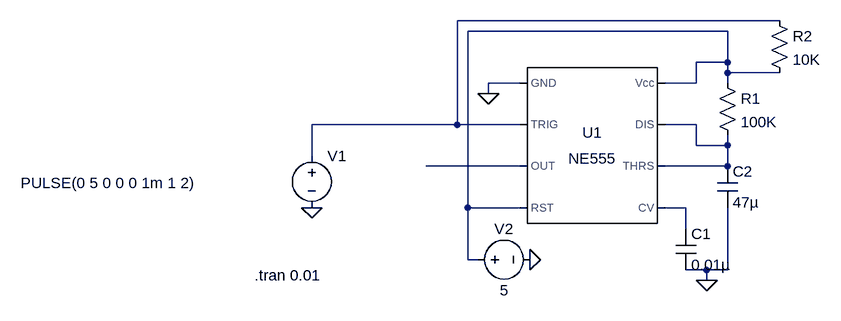
[diagram p0: schematic 555 Monostable Multivibrator.asc]
555 Monostable Multivibrator.asc, the LTspice schematic file:
Version 4
SHEET 1 880 680
WIRE 480 0 -16 0
WIRE 400 16 0 16
WIRE 400 64 400 16
WIRE 400 64 352 64
WIRE 400 80 400 64
WIRE 480 80 400 80
WIRE 80 96 32 96
WIRE 352 96 352 64
WIRE 352 96 304 96
WIRE 400 96 400 80
WIRE 32 112 32 96
WIRE -16 160 -16 0
WIRE -16 160 -240 160
WIRE 80 160 -16 160
WIRE 352 160 304 160
WIRE 352 192 352 160
WIRE 400 192 400 176
WIRE 400 192 352 192
WIRE -240 208 -240 160
WIRE 80 224 -64 224
WIRE 400 224 400 192
WIRE 400 224 304 224
WIRE 0 288 0 16
WIRE 80 288 0 288
WIRE 336 288 304 288
WIRE 336 320 336 288
WIRE 0 368 0 288
WIRE 16 368 0 368
WIRE 368 384 336 384
WIRE 400 384 400 288
WIRE 400 384 368 384
WIRE 368 400 368 384
FLAG 368 400 0
FLAG 32 112 0
FLAG -240 288 0
FLAG 96 368 0
SYMBOL Misc\\NE555 192 192 R0
SYMATTR InstName U1
SYMBOL res 384 80 R0
SYMATTR InstName R1
SYMATTR Value 100K
SYMBOL cap 384 224 R0
SYMATTR InstName C2
SYMATTR Value 47µ
SYMBOL cap 320 320 R0
SYMATTR InstName C1
SYMATTR Value 0.01µ
SYMBOL res 464 -16 R0
SYMATTR InstName R2
SYMATTR Value 10K
SYMBOL voltage -240 192 R0
WINDOW 3 -448 58 Left 2
WINDOW 123 -448 86 Left 2
WINDOW 39 0 0 Left 0
SYMATTR InstName V1
SYMATTR Value PULSE(0 5 0 0 0 1m 1 2)
SYMBOL voltage 0 368 R270
WINDOW 0 32 56 VTop 2
WINDOW 3 -32 56 VBottom 2
WINDOW 123 0 0 Left 0
WINDOW 39 0 0 Left 0
SYMATTR InstName V2
SYMATTR Value 5
TEXT -328 392 Left 2 !.tran 0.01

The netlist it stands for:
* 555 Monostable Multivibrator.asc
XU1 0 N001 N004 N002 N005 N003 N003 N002 NE555  ; pins GND TRIG OUT RST CV THRS DIS Vcc
R1 N002 N003 100K
C2 N003 0 47µ
C1 N005 0 0.01µ
R2 N001 N002 10K
V1 N001 0 PULSE(0 5 0 0 0 1m 1 2)
V2 N002 0 5
.tran 0.01
.lib NE555.sub
.backanno
.end